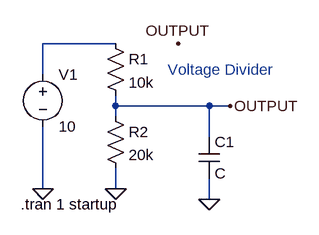
[diagram p0: schematic VOLTAGE DIVIDER.asc]
VOLTAGE DIVIDER.asc, the LTspice schematic file:
Version 4
SHEET 1 880 680
WIRE 192 64 80 64
WIRE 80 112 80 64
WIRE 192 160 192 144
WIRE 336 160 192 160
WIRE 368 160 336 160
WIRE 192 176 192 160
WIRE 336 208 336 160
WIRE 80 288 80 192
WIRE 192 288 192 256
WIRE 336 304 336 272
FLAG 80 288 0
FLAG 192 288 0
FLAG 288 64 OUTPUT
FLAG 368 160 OUTPUT
FLAG 336 304 0
SYMBOL res 176 48 R0
SYMATTR InstName R1
SYMATTR Value 10k
SYMBOL res 176 160 R0
SYMATTR InstName R2
SYMATTR Value 20k
SYMBOL voltage 80 96 R0
WINDOW 123 0 0 Left 0
WINDOW 39 0 0 Left 0
SYMATTR InstName V1
SYMATTR Value 10
SYMBOL cap 320 208 R0
SYMATTR InstName C1
TEXT 272 104 Left 2 ;Voltage Divider
TEXT 46 312 Left 2 !.tran 1 startup

The netlist it stands for:
* VOLTAGE DIVIDER.asc
R1 N001 OUTPUT 10k
R2 OUTPUT 0 20k
V1 N001 0 10
C1 OUTPUT 0 C
* Voltage Divider
.tran 1 startup
.backanno
.end